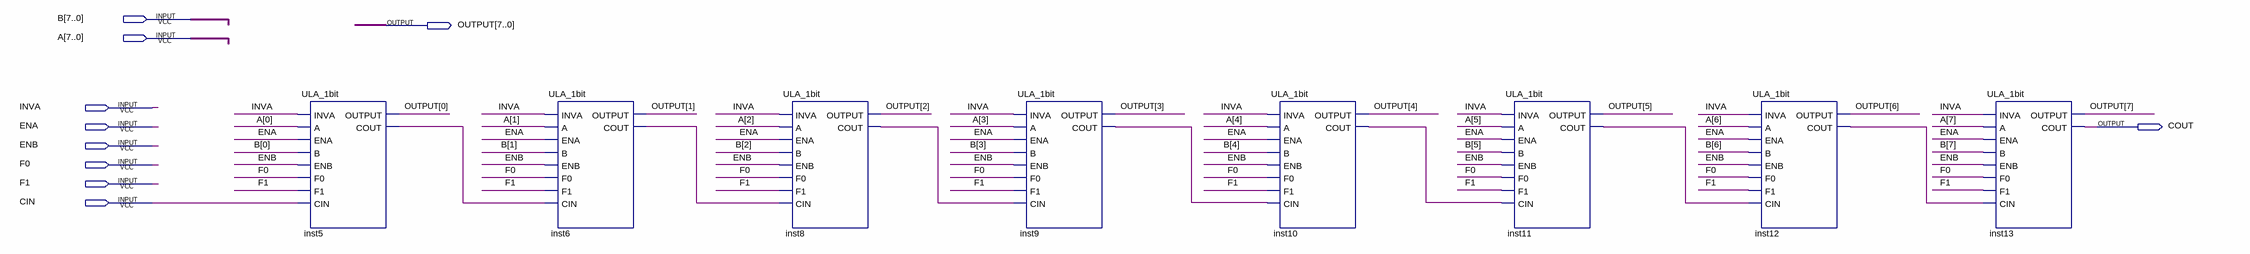
[diagram p0: schematic sheet]
// Quartus schematic ULA_8bits.bdf as structural Verilog: 8 symbols, 10 pins
module ULA_8bits (
  input  [7:0] B,
  input  [7:0] A,
  input  INVA,
  input  ENA,
  input  ENB,
  input  F0,
  input  F1,
  input  CIN,
  output [7:0] OUTPUT,
  output COUT
);

  wire inst5_cout, inst6_cout, inst8_cout, inst9_cout, inst10_cout, inst11_cout, inst12_cout;

  ULA_1bit inst5 (
    .INVA(INVA), .A(A[0]), .ENA(ENA), .B(B[0]), .ENB(ENB), .F0(F0), .F1(F1), .CIN(CIN), .OUTPUT(OUTPUT[0]),
    .COUT(inst5_cout));
  ULA_1bit inst6 (
    .INVA(INVA), .A(A[1]), .ENA(ENA), .B(B[1]), .ENB(ENB), .F0(F0), .F1(F1), .CIN(inst5_cout),
    .OUTPUT(OUTPUT[1]), .COUT(inst6_cout));
  ULA_1bit inst8 (
    .INVA(INVA), .A(A[2]), .ENA(ENA), .B(B[2]), .ENB(ENB), .F0(F0), .F1(F1), .CIN(inst6_cout),
    .OUTPUT(OUTPUT[2]), .COUT(inst8_cout));
  ULA_1bit inst9 (
    .INVA(INVA), .A(A[3]), .ENA(ENA), .B(B[3]), .ENB(ENB), .F0(F0), .F1(F1), .CIN(inst8_cout),
    .OUTPUT(OUTPUT[3]), .COUT(inst9_cout));
  ULA_1bit inst10 (
    .INVA(INVA), .A(A[4]), .ENA(ENA), .B(B[4]), .ENB(ENB), .F0(F0), .F1(F1), .CIN(inst9_cout),
    .OUTPUT(OUTPUT[4]), .COUT(inst10_cout));
  ULA_1bit inst11 (
    .INVA(INVA), .A(A[5]), .ENA(ENA), .B(B[5]), .ENB(ENB), .F0(F0), .F1(F1), .CIN(inst10_cout),
    .OUTPUT(OUTPUT[5]), .COUT(inst11_cout));
  ULA_1bit inst12 (
    .INVA(INVA), .A(A[6]), .ENA(ENA), .B(B[6]), .ENB(ENB), .F0(F0), .F1(F1), .CIN(inst11_cout),
    .OUTPUT(OUTPUT[6]), .COUT(inst12_cout));
  ULA_1bit inst13 (
    .INVA(INVA), .A(A[7]), .ENA(ENA), .B(B[7]), .ENB(ENB), .F0(F0), .F1(F1), .CIN(inst12_cout),
    .OUTPUT(OUTPUT[7]), .COUT(COUT));
endmodule
